# EAGLE design XC2C64A-CPLDbreakout-v1c (EAGLE 5.11)
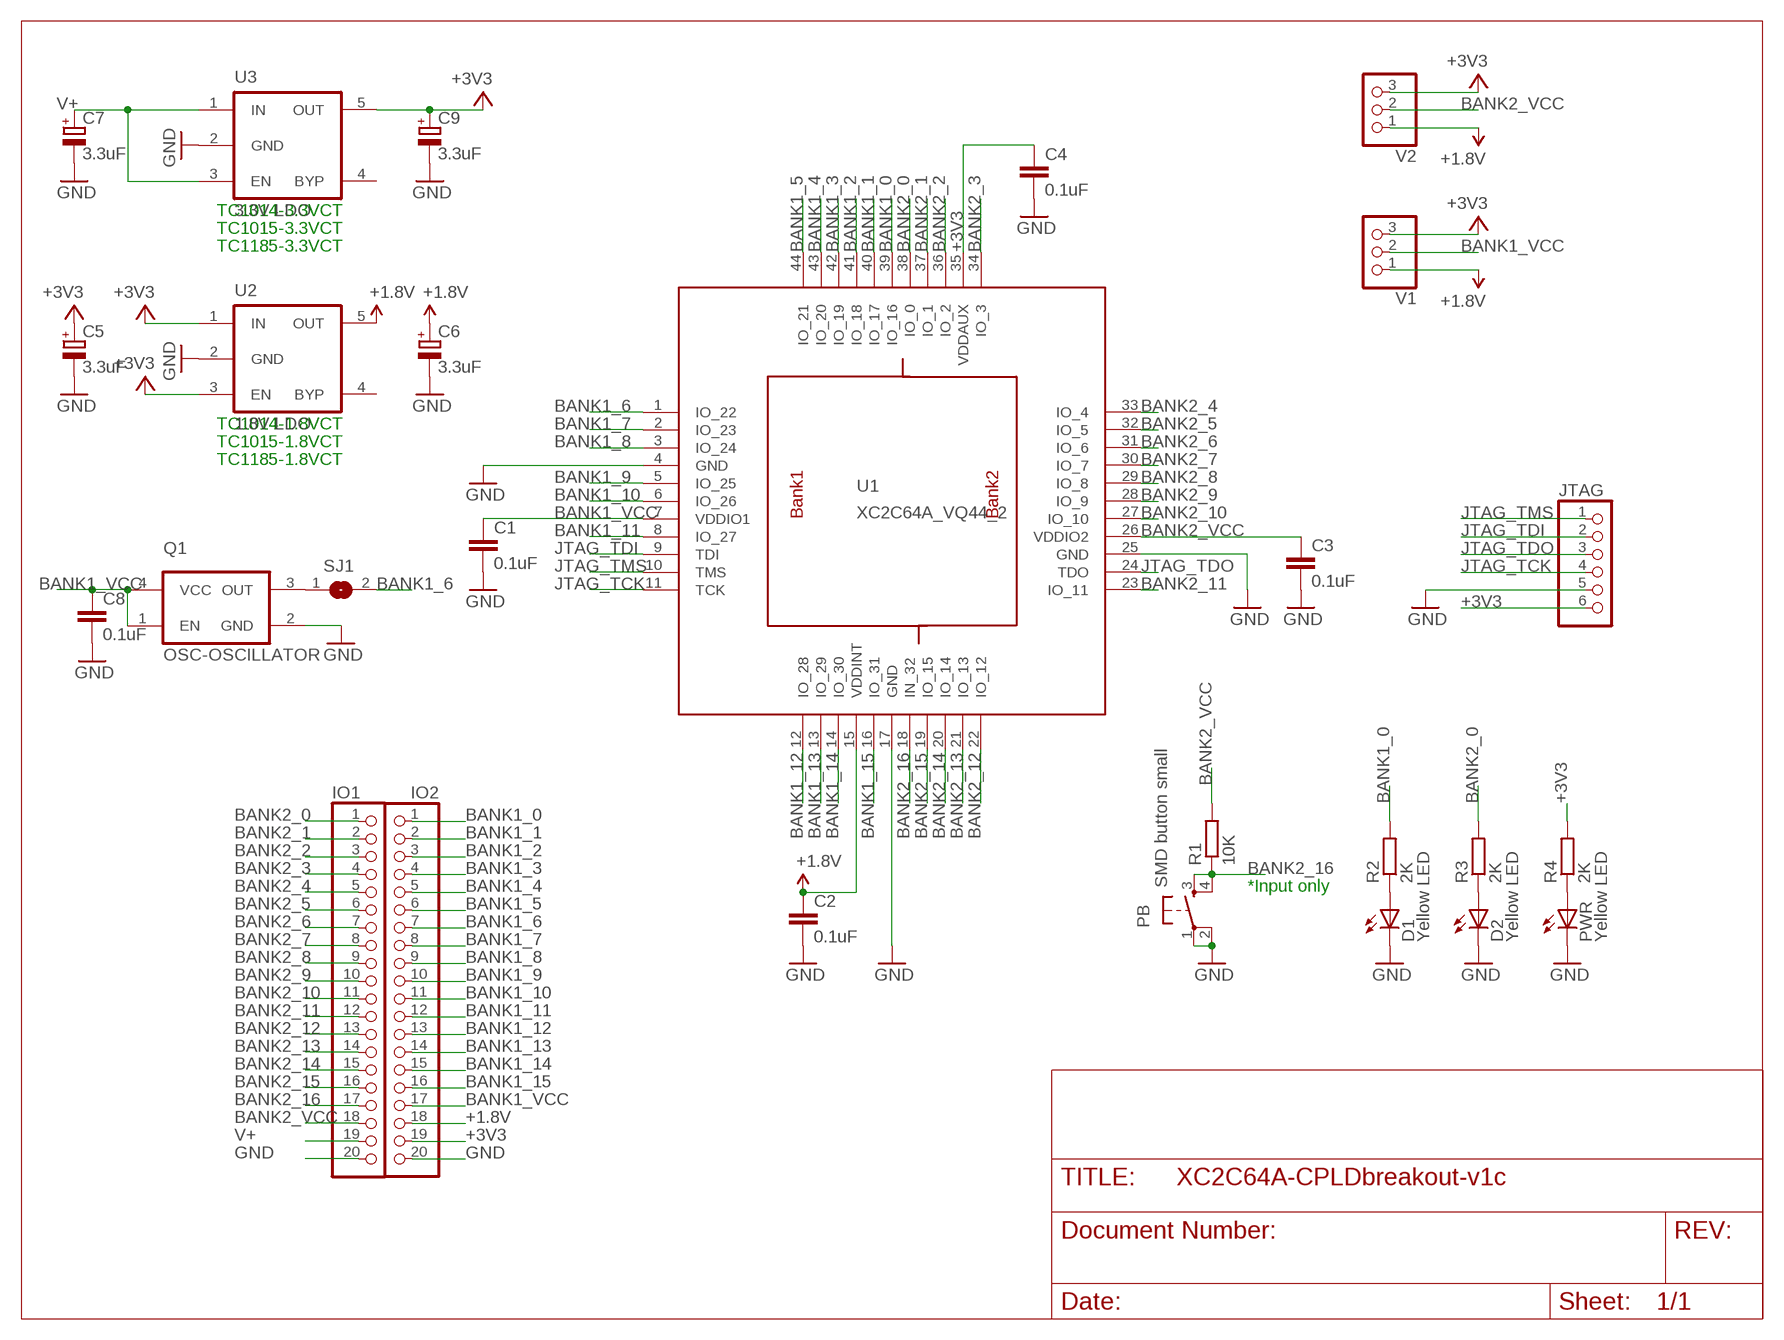
[diagram p0: schematic, sheet 1]

## Parts
C1  0.1uF  CAPC603  [C603]
C2  0.1uF  CAPC603  [C603]
C3  0.1uF  CAPC603  [C603]
C4  0.1uF  CAPC603  [C603]
C5  3.3uF  CAP_POLSMC_A  [SMC_A]
C6  3.3uF  CAP_POLSMC_A  [SMC_A]
C7  3.3uF  CAP_POLSMC_A  [SMC_A]
C8  0.1uF  CAPC603  [C603]
C9  3.3uF  CAP_POLSMC_A  [SMC_A]
D1  Yellow LED  LED805  [LED-805]
D2  Yellow LED  LED805  [LED-805]
IO1  PINHD-1X20  [1X20]
IO2  PINHD-1X20  [1X20]
JTAG  PINHD-1X6  [1X06]
PB  SMD button small  SMD_TACT_SMALL  [TACT_SWITCH_SMALL]
PWR  Yellow LED  LED805  [LED-805]
Q1  OSC-OSCILLATOR  [OSCILLATOR_7X5_SMD]
R1  10K  RESISTORR603  [R603]
R2  2K  RESISTORR603  [R603]
R3  2K  RESISTORR603  [R603]
R4  2K  RESISTORR603  [R603]
SJ1  SJ  [SJ]
U1  XC2C64A_VQ44_2  XC2C32A_VQ44_2  [VQ44]
U2  1.8V LDO  MIC5205  [SOT-23-5]
U3  3.3V LDO  MIC5205  [SOT-23-5]
V1  PINHD-1X3  [1X03]
V2  PINHD-1X3  [1X03]

## Nets
+1.8V: C2.1 C6.+ IO2.18 U1.15(VDDINT) U2.5(OUT) V1.1 V2.1
+3V3: C4.1 C5.+ C9.+ IO2.19 JTAG.6 R4.2 U1.35(VDDAUX) U2.1(IN) U2.3(EN) U3.5(OUT) V1.3 V2.3
BANK1_0: IO2.1 R2.2 U1.39(IO_16)
BANK1_1: IO2.2 U1.40(IO_17)
BANK1_2: IO2.3 U1.41(IO_18)
BANK1_3: IO2.4 U1.42(IO_19)
BANK1_4: IO2.5 U1.43(IO_20)
BANK1_5: IO2.6 U1.44(IO_21)
BANK1_6: IO2.7 SJ1.2 U1.1(IO_22)
BANK1_7: IO2.8 U1.2(IO_23)
BANK1_8: IO2.9 U1.3(IO_24)
BANK1_9: IO2.10 U1.5(IO_25)
BANK1_10: IO2.11 U1.6(IO_26)
BANK1_11: IO2.12 U1.8(IO_27)
BANK1_12: IO2.13 U1.12(IO_28)
BANK1_13: IO2.14 U1.13(IO_29)
BANK1_14: IO2.15 U1.14(IO_30)
BANK1_15: IO2.16 U1.16(IO_31)
BANK1_VCC: C1.1 C8.1 IO2.17 Q1.1(EN) Q1.4(VCC) U1.7(VDDIO1) V1.2
BANK2_0: IO1.1 R3.2 U1.38(IO_0)
BANK2_1: IO1.2 U1.37(IO_1)
BANK2_2: IO1.3 U1.36(IO_2)
BANK2_3: IO1.4 U1.34(IO_3)
BANK2_4: IO1.5 U1.33(IO_4)
BANK2_5: IO1.6 U1.32(IO_5)
BANK2_6: IO1.7 U1.31(IO_6)
BANK2_7: IO1.8 U1.30(IO_7)
BANK2_8: IO1.9 U1.29(IO_8)
BANK2_9: IO1.10 U1.28(IO_9)
BANK2_10: IO1.11 U1.27(IO_10)
BANK2_11: IO1.12 U1.23(IO_11)
BANK2_12: IO1.13 U1.22(IO_12)
BANK2_13: IO1.14 U1.21(IO_13)
BANK2_14: IO1.15 U1.20(IO_14)
BANK2_15: IO1.16 U1.19(IO_15)
BANK2_16: IO1.17 PB.3 PB.4 R1.1 U1.18(IN_32)
BANK2_VCC: C3.1 IO1.18 R1.2 U1.26(VDDIO2) V2.2
GND: C1.2 C2.2 C3.2 C4.2 C5.- C6.- C7.- C8.2 C9.- D1.C D2.C IO1.20 IO2.20 JTAG.5 PB.1 PB.2 PWR.C Q1.2(GND) U1.4(GND) U1.17(GND) U1.25(GND) U2.2(GND) U3.2(GND)
JTAG_TCK: JTAG.4 U1.11(TCK)
JTAG_TDI: JTAG.2 U1.9(TDI)
JTAG_TDO: JTAG.3 U1.24(TDO)
JTAG_TMS: JTAG.1 U1.10(TMS)
N$1: D1.A R2.1
N$2: D2.A R3.1
N$3: PWR.A R4.1
N$5: Q1.3(OUT) SJ1.1
V+: C7.+ IO1.19 U3.1(IN) U3.3(EN)
Unconnected: U2.4(BYP) U3.4(BYP)

## Notes on the sheet
- TC1014-3.3VCT
- TC1015-3.3VCT
- TC1185-3.3VCT
- TC1014-1.8VCT
- TC1015-1.8VCT
- TC1185-1.8VCT
- *Input only

## Library data of the parts
C1-C4 C8 = dp_devices:CAP
C5-C7 C9 = dp_devices:CAP_POL
D1 D2 PWR = dp_devices:LED
IO1 IO2 = pinhead:PINHD-1X20: PIN HEADER
JTAG = pinhead:PINHD-1X6: PIN HEADER
PB = dp_devices:SMD_TACT_SMALL
Q1 = dp_devices:OSC-OSCILLATOR: Oscillator
R1-R4 = dp_devices:RESISTOR
SJ1 = jumper:SJ: SMD solder JUMPER
U1 = dp_devices:XC2C32A_VQ44_2: xc2c32a_vq44-ian edit this description Auto generated by make-symbol-device-package-bsdl.ulp Rev. 29 Source: xc2c32a_vq44-ian.bsd
U2 U3 = dp_devices:MIC5205: 150ma Low-Noise LDO Regulator
V1 V2 = pinhead:PINHD-1X3: PIN HEADER

## Board
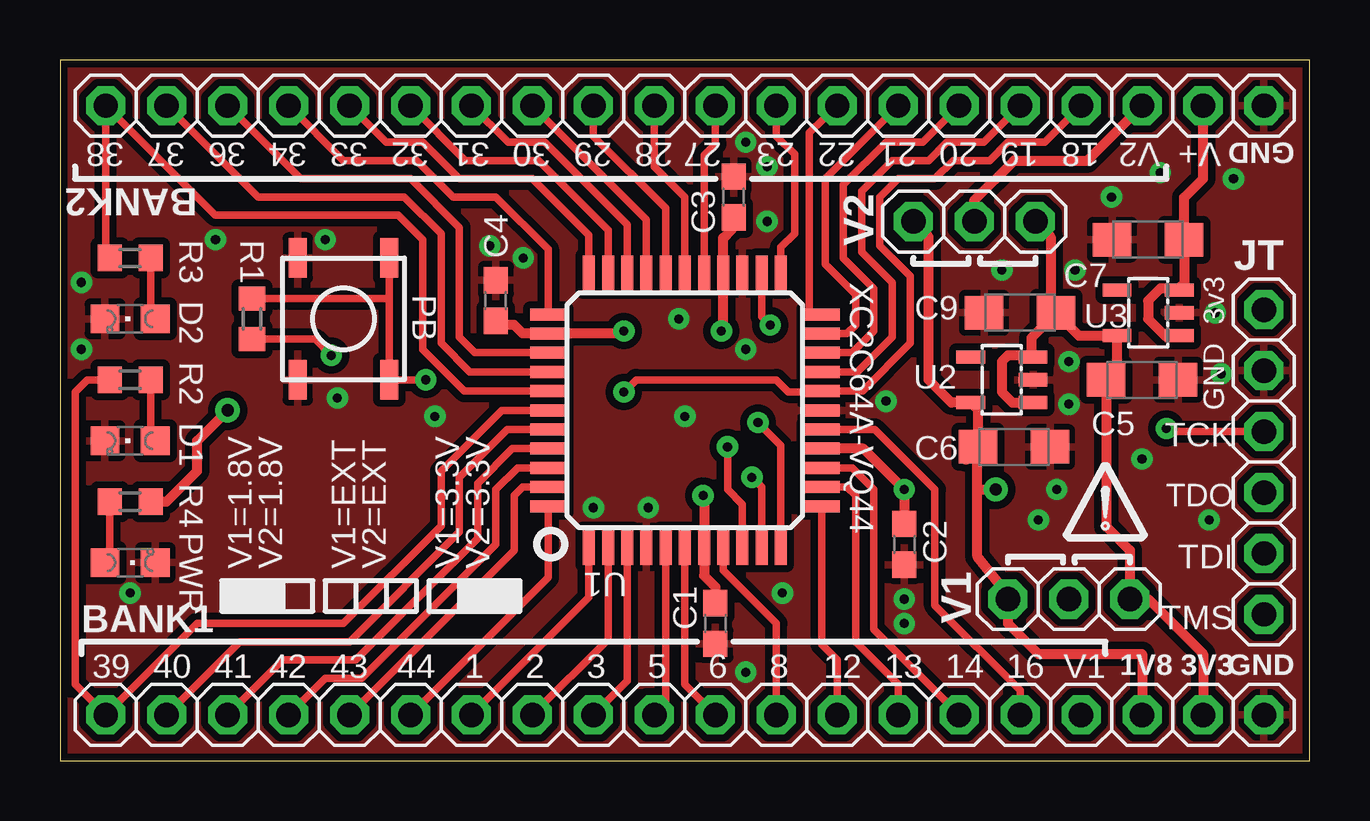
[diagram p1: board, top side]
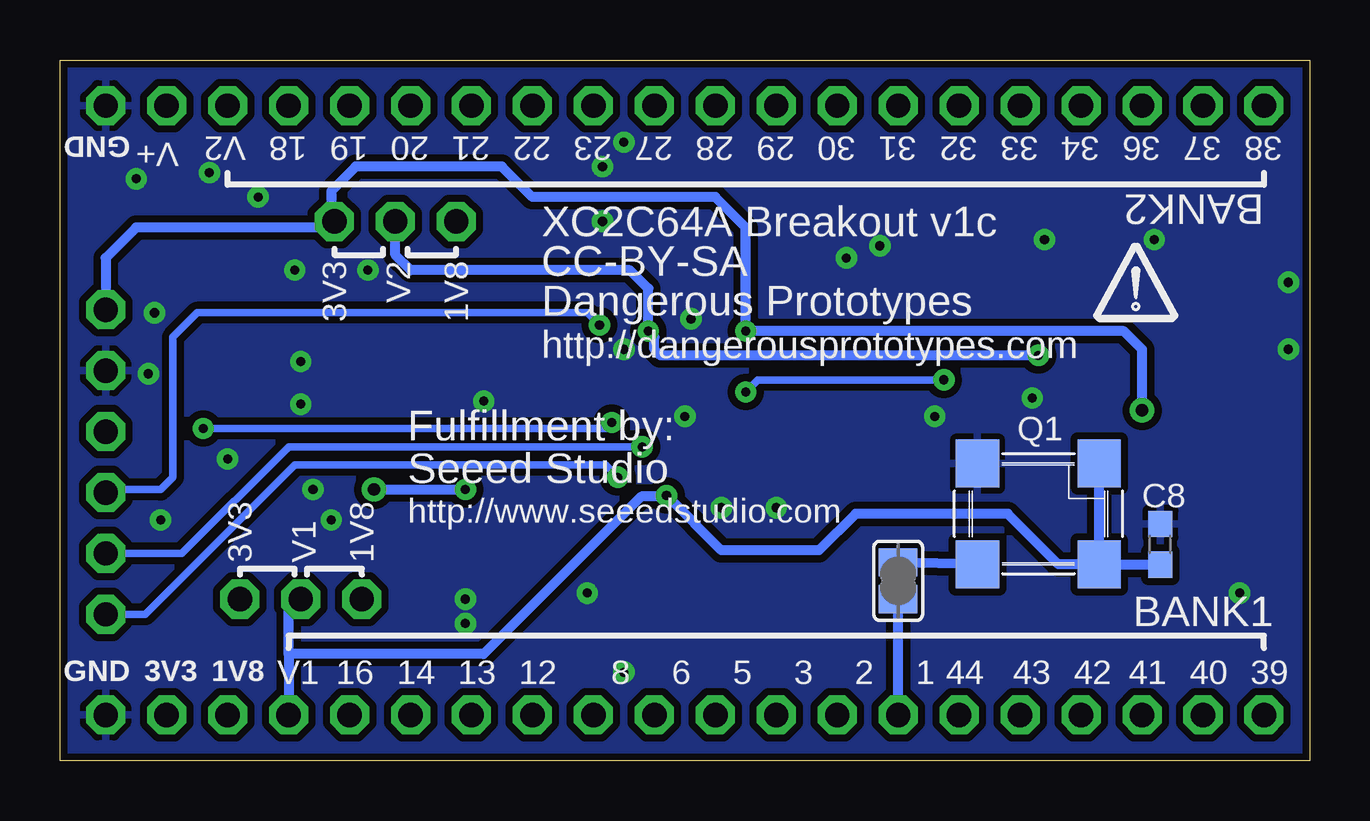
[diagram p2: board, bottom side, seen from below]

Size 52.07 x 29.21 mm. Coordinates in mm from the lower left corner, seen from the top.
Outline: 0,0 52.07,0 52.07,29.21 0,29.21 0,0
Copper layers (1*16): Top 0.035mm / dielectric 1.5mm / Bottom 0.035mm
Design rules "SparkFun *": minimum track width 8mil, minimum drill 15mil, track to track 8mil, track to pad 8mil, pad to pad 8mil, via to via 8mil, smd to smd 8mil, copper to edge 10mil, drill to drill 8mil, minimum pad ring 12mil, minimum via ring 10mil, stop-mask expansion 4mil, vias tented up to drill 25mil, thermal gap 10mil

### Footprints (pad centres in the part's own frame; a part is rotated, then mirrored left to right if it is on the bottom)
C603 = smd 1.1 x 1: 1 -0.85,0; 2 0.85,0
SMC_A = smd 1.6 x 1.4: + -1.5,0; - 1.5,0
LED-805 = smd 1.2 x 1.2: A 0,-1.05; C 0,1.05
1X20 = drill 1.016 octagon: 1 -24.13,0; 2 -21.59,0; 3 -19.05,0; 4 -16.51,0; 5 -13.97,0; 6 -11.43,0; 7 -8.89,0; 8 -6.35,0; 9 -3.81,0; 10 -1.27,0; 11 1.27,0; 12 3.81,0; 13 6.35,0; 14 8.89,0; 15 11.43,0; 16 13.97,0; 17 16.51,0; 18 19.05,0; 19 21.59,0; 20 24.13,0
1X06 = drill 1.016 octagon: 1 -6.35,0; 2 -3.81,0; 3 -1.27,0; 4 1.27,0; 5 3.81,0; 6 6.35,0
TACT_SWITCH_SMALL = smd 1.651 x 0.762: 1 -2.54,1.905; 2 2.54,1.905; 3 -2.54,-1.905; 4 2.54,-1.905
OSCILLATOR_7X5_SMD = smd 1.8 x 2: 1 -2.54,-2.1; 2 2.54,-2.1; 3 2.54,2.1; 4 -2.54,2.1
R603 = smd 1 x 1.1: 1 -0.85,0; 2 0.85,0
SJ = smd 1.168 x 1.6: 1 -0.762,0; 2 0.762,0
VQ44 = smd 1.5 x 0.5: 1 -5.7,4; 2 -5.7,3.2; 3 -5.7,2.4; 4 -5.7,1.6; 5 -5.7,0.8; 6 -5.7,0; 7 -5.7,-0.8; 8 -5.7,-1.6; 9 -5.7,-2.4; 10 -5.7,-3.2; 11 -5.7,-4; 23 5.7,-4; 24 5.7,-3.2; 25 5.7,-2.4; 26 5.7,-1.6; 27 5.7,-0.8; 28 5.7,0; 29 5.7,0.8; 30 5.7,1.6; 31 5.7,2.4; 32 5.7,3.2; 33 5.7,4 | smd 0.5 x 1.5: 12 -4,-5.7; 13 -3.2,-5.7; 14 -2.4,-5.7; 15 -1.6,-5.7; 16 -0.8,-5.7; 17 0,-5.7; 18 0.8,-5.7; 19 1.6,-5.7; 20 2.4,-5.7; 21 3.2,-5.7; 22 4,-5.7; 34 4,5.7; 35 3.2,5.7; 36 2.4,5.7; 37 1.6,5.7; 38 0.8,5.7; 39 0,5.7; 40 -0.8,5.7; 41 -1.6,5.7; 42 -2.4,5.7; 43 -3.2,5.7; 44 -4,5.7
SOT-23-5 = smd 0.55 x 1.2: 1 -0.95,-1.3; 2 0,-1.3; 3 0.95,-1.3; 4 0.95,1.3; 5 -0.95,1.3
1X03 = drill 1.016 octagon: 1 -2.54,0; 2 0,0; 3 2.54,0

### Placement (x,y rotation side)
C1  27.3,5.71 270 top
C2  35.18,9.02 270 top
C3  28.07,23.49 90 top
C4  18.16,19.18 90 top
C5  45.09,15.88 0 top
C6  39.75,13.08 0 top
C7  45.34,21.72 180 top
C8  6.22,9.02 90 bottom
C9  40.01,18.67 180 top
D1  2.92,13.34 90 top
D2  2.92,18.41 90 top
IO1  26.04,27.3 0 top
IO2  26.04,1.91 0 top
JTAG  50.16,12.45 90 top
PB  11.81,18.41 90 top
PWR  2.92,8.26 270 top
Q1  11.3,10.29 180 bottom
R1  8,18.41 270 top
R2  2.92,15.88 180 top
R3  2.92,20.95 180 top
R4  2.92,10.79 0 top
SJ1  17.14,7.49 270 bottom
U1  26.04,14.61 90 top
U2  39.24,15.88 90 top
U3  45.34,18.67 90 top
U$5  [DP_LOGO]  43.56,9.78 0 top
U$9  [DP_LOGO]  7.24,18.92 0 bottom
V1  42.04,6.73 0 top
V2  38.1,22.48 0 top

### Tracks (layer width: path | path; a pad name or v marks a point on that pad's centre or on a via)
+1.8V  (via drill 0.38, 0.51)
  Top 0.406: U1.15 33.48,13.01 v35.18,11.3 C2.1 | IO2.18 45.09,4.45 40.77,4.45 39.5,5.71 V1.1 39.24,6.99 39.24,7.24 38.23,8.51 38.23,11.3 | C6.+ 37.74,12.55 | 38.23,11.3 38.23,13.06 C6.+ | C6.+ 38.25,14.62 U2.5 37.15,14.93 36.2,15.88 36.2,21.84 V2.1 | 38.23,11.3 v38.99,11.3
  Bottom 0.406: V2.1 35.69,22.48 | v38.99,11.3 v35.18,11.3
+3V3  (via drill 0.38, 0.51)
  Top 0.406: v23.49,17.91 23.39,17.8 U1.35 19.28,17.8 18.92,18.16 18.33,18.16 C4.1 | IO2.19 47.62,4.45 45.34,6.73 V1.3 44.58,8.76 43.59,9.76 C5.+ 44.04,16.33 U3.5 42.46,17.72 C9.+ 41.27,18.44 | U2.1 39.69,14.93 39.24,15.37 39.24,16.64 39.5,16.89 40.48,16.89 | 40.48,16.89 U2.3 | 40.74,22.38 V2.3 41.27,21.84 41.27,18.44 | R4.2 4.45,10.79 5.71,12.06 5.71,13.34 v6.99,14.61 | 40.48,16.89 40.48,17.62 41.27,18.41 41.27,18.44
  Bottom 0.406: v6.99,14.61 6.99,17.14 7.75,17.91 v23.49,17.91 23.49,22.22 24.76,23.49 32.39,23.49 33.66,24.76 39.75,24.76 40.77,23.75 40.77,22.61 V2.3 40.89,22.22 48.9,22.22 50.16,20.95 JTAG.6
BANK1_0
  Top 0.305: R2.2 1.14,15.88 0.64,15.37 0.64,3.17 IO2.1 5.71,5.71 11.81,5.71 15.88,9.78 15.88,12.06 18.41,14.61 U1.39
BANK1_1
  Top 0.305: U1.40 18.63,13.8 16.64,11.81 16.64,9.53 12.06,4.95 7.49,4.95 IO2.2
BANK1_2
  Top 0.305: U1.41 18.85,13.01 17.4,11.56 17.4,9.27 12.32,4.19 9.27,4.19 IO2.3
BANK1_3
  Top 0.305: U1.42 19.06,12.21 18.16,11.3 18.16,9.02 12.57,3.43 11.05,3.43 IO2.4
BANK1_4
  Top 0.305: U1.43 19.28,11.4 18.92,11.05 18.92,8.76 IO2.5
BANK1_5
  Top 0.305: U1.44 20.33,7.63 IO2.6
BANK1_6
  Top 0.305: U1.1 22.04,6.79 IO2.7
  Bottom 0.406: IO2.7 SJ1.2
BANK1_7
  Top 0.305: U1.2 22.83,5.06 IO2.8
BANK1_8
  Top 0.305: U1.3 23.63,3.32 IO2.9
BANK1_9
  Top 0.305: U1.5 25.23,2.38 IO2.10
BANK1_10
  Top 0.305: IO2.11 26.04,3.17 U1.6
BANK1_11
  Top 0.305: U1.8 27.63,7.93 29.84,5.71 IO2.12
BANK1_12
  Top 0.305: U1.12 31.73,4.84 32.39,4.19 IO2.13
BANK1_13
  Top 0.305: U1.13 32.79,11.4 33.15,11.05 33.15,4.95 34.93,3.17 IO2.14
BANK1_14
  Top 0.305: U1.14 33.01,12.21 33.91,11.3 33.91,5.46 IO2.15
BANK1_15
  Top 0.305: U1.16 33.95,13.8 36.45,11.3 36.45,6.48 40.01,2.92 IO2.16
BANK1_VCC  (via drill 0.38)
  Top 0.406: C1.1 27.3,7.24 26.83,7.71 U1.7 26.83,11.01 v26.8,11.05
  Bottom 0.406: C8.1 8.49,8.17 Q1.4 | Q1.4 Q1.1 | Q1.4 10.47,8.19 12.57,10.29 18.92,10.29 20.45,8.76 24.51,8.76 v26.8,11.05 26.83,11.01 27.85,11.01 34.42,4.45 42.55,4.45 | 42.55,4.45 IO2.17 | 42.55,4.45 42.55,6.22 V1.2
BANK2_0
  Top 0.305: U1.38 16.85,15.4 15.11,17.14 15.11,21.72 14.1,22.73 6.48,22.73 IO1.1 1.91,21.21 2.07,21.04 R3.2
BANK2_1
  Top 0.305: U1.37 17.07,16.2 15.88,17.4 15.88,21.97 14.35,23.49 8.26,23.49 IO1.2
BANK2_2
  Top 0.305: U1.36 17.29,17 16.64,17.65 16.64,22.22 14.61,24.26 10.03,24.26 IO1.3
BANK2_3
  Top 0.305: U1.34 20.33,21.32 18.16,23.49 16.38,23.49 14.86,25.02 11.81,25.02 IO1.4
BANK2_4
  Top 0.305: IO1.5 13.59,25.78 15.11,25.78 16.64,24.26 19.68,24.26 22.04,21.91 U1.33
BANK2_5
  Top 0.305: IO1.6 16.89,25.02 19.94,25.02 22.83,22.12 U1.32
BANK2_6
  Top 0.305: IO1.7 18.67,25.78 20.19,25.78 23.63,22.34 U1.31
BANK2_7
  Top 0.305: U1.30 24.43,22.55 IO1.8
BANK2_8
  Top 0.305: U1.29 25.23,23.02 22.22,26.04 IO1.9
BANK2_9
  Top 0.305: U1.28 26.04,23.49 24.76,24.76 IO1.10
BANK2_10
  Top 0.305: U1.27 26.83,25.23 27.3,25.7 IO1.11
BANK2_11
  Top 0.305: IO1.12 29.84,26.04 30.61,25.27 30.61,21.97 30.04,21.4 U1.23
BANK2_12
  Top 0.305: IO1.13 31.23,26.18 31.23,18.6 U1.22
BANK2_13
  Top 0.305: U1.21 32.79,17.8 33.15,18.16 33.15,19.43 31.88,20.7 31.88,24.26 IO1.14
BANK2_14
  Top 0.305: U1.20 33.01,17 33.91,17.91 33.91,19.68 32.64,20.95 32.64,24 34.42,25.78 35.94,25.78 IO1.15
BANK2_15
  Top 0.305: U1.19 33.22,16.2 34.67,17.65 34.67,19.94 33.4,21.21 33.4,23.75 34.67,25.02 36.2,25.02 36.96,25.78 38.48,25.78 IO1.16
BANK2_16  (via drill 0.38)
  Top 0.305: IO1.17 41.02,25.78 39.5,25.78 38.73,25.02 37.21,25.02 36.45,24.26 34.93,24.26 34.16,23.49 34.16,21.46 35.43,20.19 35.43,17.4 33.44,15.4 U1.18 31.7,15.37 30.35,15.37 29.84,15.88 24,15.88 v23.49,15.37 | 13.72,19.26 PB.4 | v15.24,15.88 PB.3 13.72,19.26 | R1.1 13.72,19.26
  Bottom 0.305: v15.24,15.88 22.99,15.88 v23.49,15.37
BANK2_VCC  (via drill 0.38)
  Top 0.305: R1.2 10.63,17.56 v11.3,16.89
  Top 0.406: C3.1 28.07,22.73 27.98,22.64 27.98,22.14 27.63,21.79 U1.26 27.63,17.98 v27.56,17.91 | V2.2 38.1,23.37 39.75,25.02 42.8,25.02 IO1.18
  Bottom 0.406: V2.2 38.1,21.08 37.47,20.45 28.32,20.45 27.56,19.68 v27.56,17.91 27.3,17.65 27.3,17.14 27.05,16.89 v11.3,16.89
GND  (via drill 0.38)
  other vias: 17.91,21.46 30.1,6.99 35.18,6.73 24.51,10.54 28.57,3.68 29.46,24.76 34.42,14.99 25.78,18.41 19.3,20.95 35.18,5.71 28.57,17.14 22.22,10.54 0.89,17.14 0.89,19.94 2.92,6.99 45.85,24.51 48.9,24.26 42.04,16.64 47.88,10.03 28.57,25.78 11.05,21.72 6.48,21.72 11.56,15.11 15.62,14.35 29.46,22.48 26.04,14.35 40.77,10.03 41.53,11.3 42.04,14.86 48.39,16.13 43.82,23.49 48.13,18.67 39.24,20.45 42.29,20.45 45.09,12.57
  pour Bottom (isolate 0.305): 0,0 52.07,0 52.07,29.21 0,29.21
  pour Top (isolate 0.305): -0.64,-0.64 52.71,-0.64 52.71,29.84 -0.64,29.84
JTAG_TCK  (via drill 0.38)
  Top 0.305: v29.08,14.1 30.04,13.14 U1.11 | JTAG.4 46.23,13.72 v46.1,13.84
  Bottom 0.305: 29.21,13.97 v29.08,14.1 29.34,13.84 v46.1,13.84
JTAG_TDI  (via drill 0.38)
  Top 0.305: U1.9 28.43,10.68 27.81,11.3 v27.81,13.08
  Bottom 0.305: v27.81,13.08 42.55,13.08 46.99,8.64 JTAG.2
JTAG_TDO  (via drill 0.38)
  Top 0.305: v29.59,18.16 29.23,18.52 U1.24
  Bottom 0.305: v29.59,18.16 30.1,18.67 46.36,18.67 47.37,17.65 47.37,11.81 47.88,11.3 50.04,11.3 JTAG.3
JTAG_TMS  (via drill 0.38)
  Top 0.305: v28.83,11.81 29.23,11.4 U1.10
  Bottom 0.305: JTAG.1 48.51,6.1 42.29,12.32 29.34,12.32 v28.83,11.81
N$1
  Top 0.305: R2.1 3.77,13.28 D1.A
N$2
  Top 0.305: R3.1 3.77,18.61 D2.A
N$3
  Top 0.305: R4.1 2.07,8.46 PWR.A
N$5
  Bottom 0.406: Q1.3 SJ1.1
V+
  Top 0.406: IO1.19 47.62,24.26 46.84,23.47 C7.+ 46.86,21.69 46.86,19.94 46.54,19.62 U3.3 46.57,19.68 45.85,19.68 45.34,19.18 45.34,18.41 46.04,17.72 U3.1

### Text on the board
tNames: 38 | 37 | 36 | 34 | 33 | 32 | 31 | 30 | 29 | 28 | 27 | 23 | 22 | 21 | 20 | 19 | 18 | V2 | V+ | GND | BANK2 | V2 | XC2C64A-VQ44 | 3v3 | JT | GND | TCK | TDO | TDI | V1=1.8V | V2=1.8V | V1=EXT | V2=EXT | V1=3.3V | V2=3.3V | TMS | BANK1 | V1 | 39 | 40 | 41 | 42 | 43 | 44 | 1 | 2 | 3 | 5 | 6 | 8 | 12 | 13 | 14 | 16 | V1 | 1V8 | 3V3 | GND
bNames: 38 | 37 | 36 | 34 | 33 | 32 | 31 | 30 | 29 | 28 | 27 | 23 | 22 | 21 | 20 | 19 | 18 | V2 | GND | V+ | BANK2 | XC2C64A Breakout v1c | CC-BY-SA | 1V8 | V2 | 3V3 | Dangerous Prototypes | http://dangerousprototypes.com | Fulfillment by: | Seeed Studio | http://www.seeedstudio.com | 1V8 | V1 | 3V3 | BANK1 | 39 | 40 | 41 | 42 | 43 | 44 | 1 | 2 | 3 | 5 | 6 | 8 | 12 | 13 | 14 | 16 | V1 | 1V8 | 3V3 | GND
tDocu: Dangerous Prototypes | CPLD Breakout v1c | CC-BY-SA